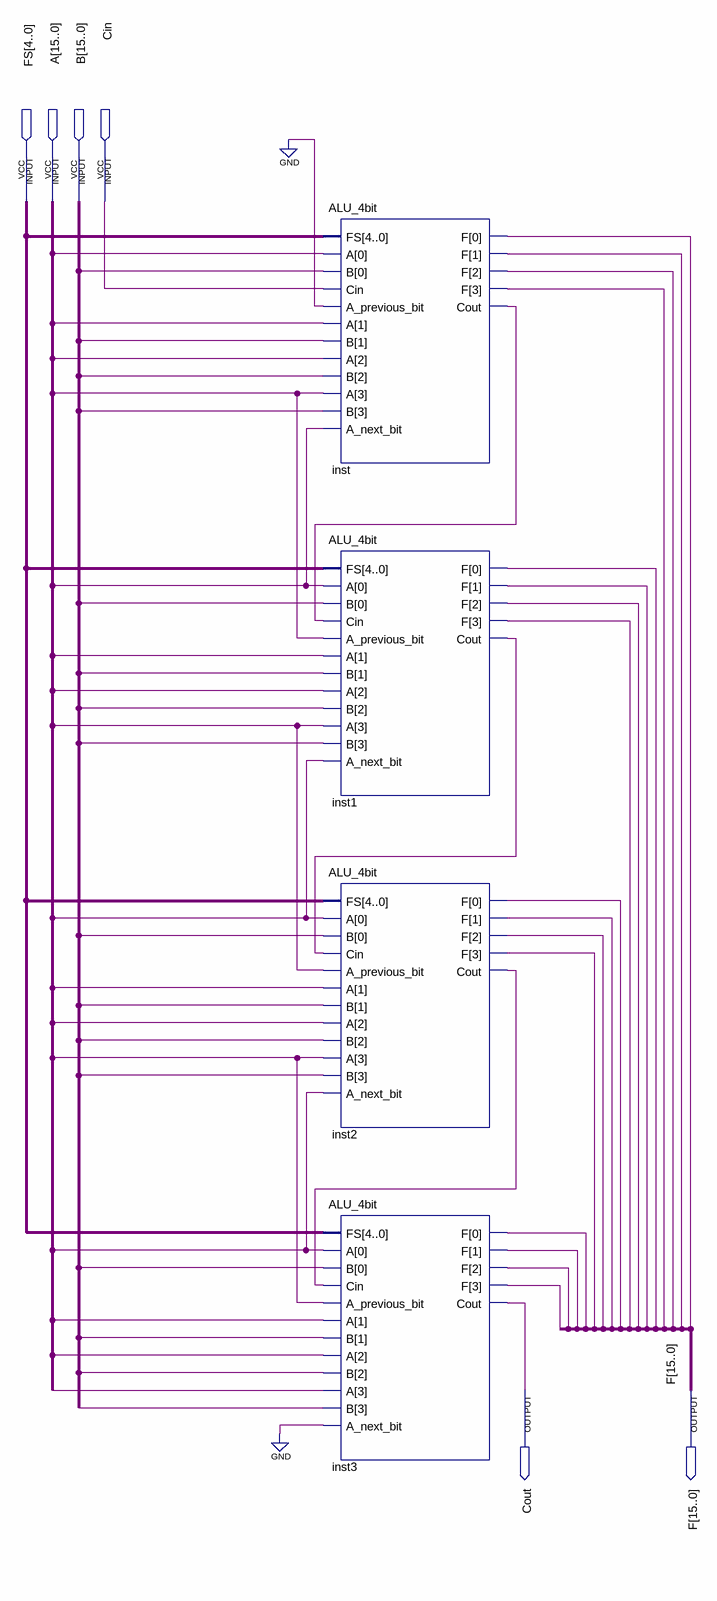
[diagram p0: schematic sheet]
// Quartus schematic ALU_16bit.bdf as structural Verilog: 4 symbols, 6 pins
module ALU_16bit (
  input  [4:0] FS,
  input  [15:0] A,
  input  [15:0] B,
  input  Cin,
  output Cout,
  output [15:0] F
);

  wire inst1_cout, inst2_cout, inst_cout;

  ALU_4bit inst (
    .FS(FS), .A(A[3:0]), .B(B[3:0]), .Cin(Cin), .A_previous_bit(1'b0), .A_next_bit(A[4]), .F(F[3:0]),
    .Cout(inst_cout));
  ALU_4bit inst1 (
    .FS(FS), .A(A[7:4]), .B(B[7:4]), .Cin(inst_cout), .A_previous_bit(A[3]), .A_next_bit(A[8]), .F(F[7:4]),
    .Cout(inst1_cout));
  ALU_4bit inst2 (
    .FS(FS), .A(A[11:8]), .B(B[11:8]), .Cin(inst1_cout), .A_previous_bit(A[7]), .A_next_bit(A[12]),
    .F(F[11:8]), .Cout(inst2_cout));
  ALU_4bit inst3 (
    .FS(FS), .A(A[15:12]), .B(B[15:12]), .Cin(inst2_cout), .A_previous_bit(A[11]), .A_next_bit(1'b0),
    .F(F[15:12]), .Cout(Cout));
endmodule
